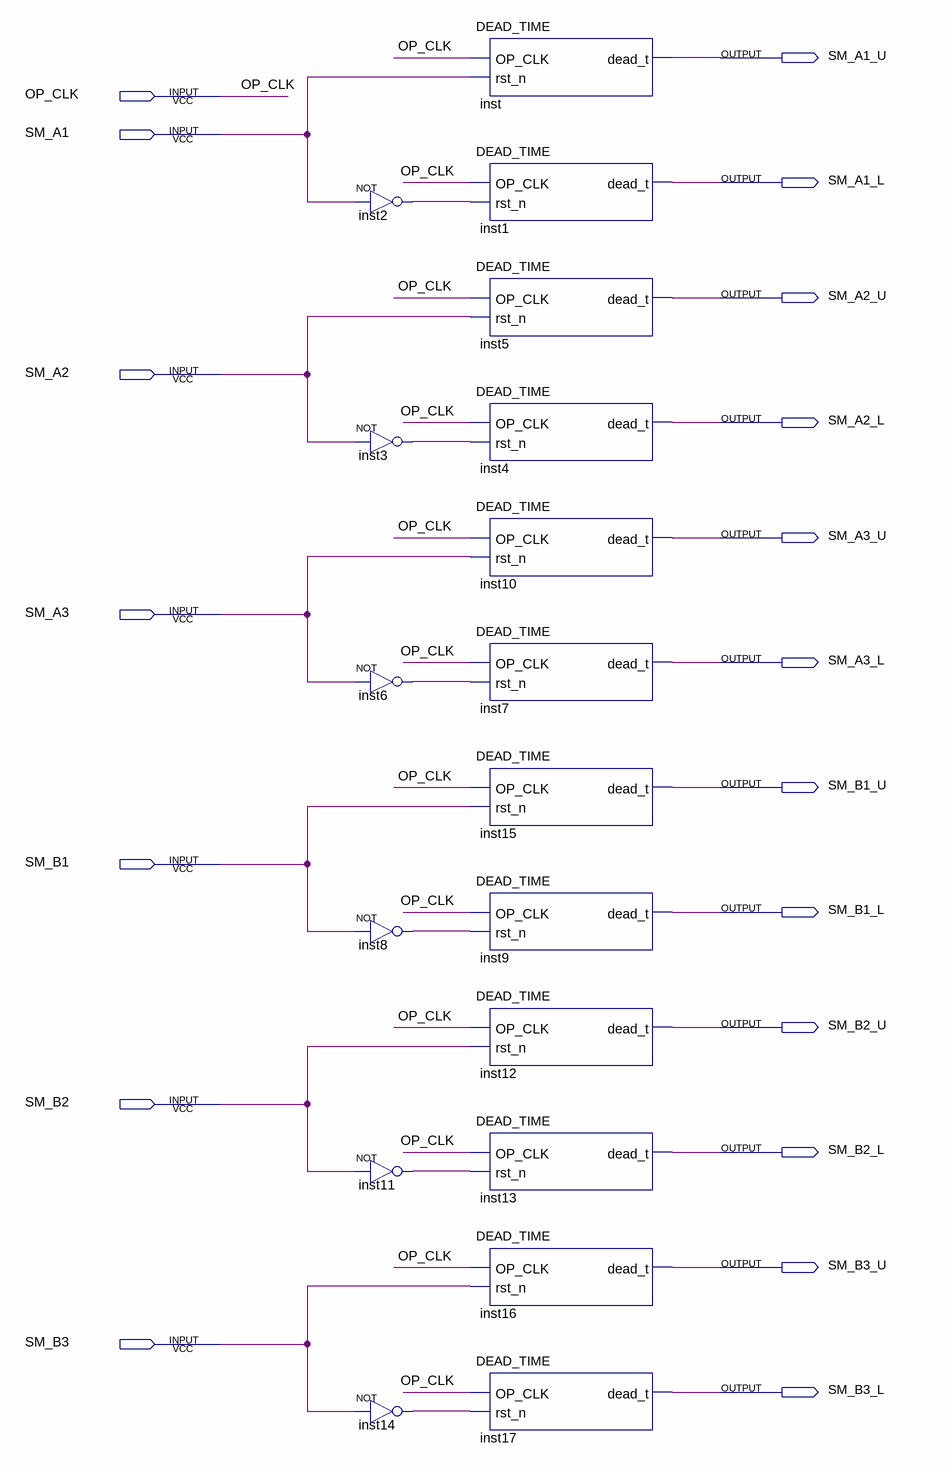
[diagram p0: schematic sheet]
// Quartus schematic DEADTIME_HB6.bdf as structural Verilog: 18 symbols, 19 pins
module DEADTIME_HB6 (
  input  OP_CLK,
  input  SM_A1,
  input  SM_A2,
  input  SM_A3,
  input  SM_B1,
  input  SM_B2,
  input  SM_B3,
  output SM_A1_U,
  output SM_A1_L,
  output SM_A2_U,
  output SM_A2_L,
  output SM_A3_U,
  output SM_A3_L,
  output SM_B1_U,
  output SM_B1_L,
  output SM_B2_U,
  output SM_B2_L,
  output SM_B3_U,
  output SM_B3_L
);

  wire inst2_out, inst3_out, inst6_out, inst8_out, inst11_out, inst14_out;

  not inst2 (inst2_out, SM_A1);
  not inst3 (inst3_out, SM_A2);
  not inst6 (inst6_out, SM_A3);
  not inst8 (inst8_out, SM_B1);
  not inst11 (inst11_out, SM_B2);
  not inst14 (inst14_out, SM_B3);
  DEAD_TIME inst (.OP_CLK(OP_CLK), .rst_n(SM_A1), .dead_t(SM_A1_U));
  DEAD_TIME inst1 (.OP_CLK(OP_CLK), .rst_n(inst2_out), .dead_t(SM_A1_L));
  DEAD_TIME inst5 (.OP_CLK(OP_CLK), .rst_n(SM_A2), .dead_t(SM_A2_U));
  DEAD_TIME inst4 (.OP_CLK(OP_CLK), .rst_n(inst3_out), .dead_t(SM_A2_L));
  DEAD_TIME inst10 (.OP_CLK(OP_CLK), .rst_n(SM_A3), .dead_t(SM_A3_U));
  DEAD_TIME inst7 (.OP_CLK(OP_CLK), .rst_n(inst6_out), .dead_t(SM_A3_L));
  DEAD_TIME inst15 (.OP_CLK(OP_CLK), .rst_n(SM_B1), .dead_t(SM_B1_U));
  DEAD_TIME inst9 (.OP_CLK(OP_CLK), .rst_n(inst8_out), .dead_t(SM_B1_L));
  DEAD_TIME inst12 (.OP_CLK(OP_CLK), .rst_n(SM_B2), .dead_t(SM_B2_U));
  DEAD_TIME inst13 (.OP_CLK(OP_CLK), .rst_n(inst11_out), .dead_t(SM_B2_L));
  DEAD_TIME inst16 (.OP_CLK(OP_CLK), .rst_n(SM_B3), .dead_t(SM_B3_U));
  DEAD_TIME inst17 (.OP_CLK(OP_CLK), .rst_n(inst14_out), .dead_t(SM_B3_L));
endmodule
